# EasyEDA schematic 1-Schematic_Antenna power supply (SMD).json
TITLE: Antenna power supply (SMD): Main module; REV: 1.5.EE; Date: 2019-10-30; Sheet: 1/1; Drawn By: IgrikXD
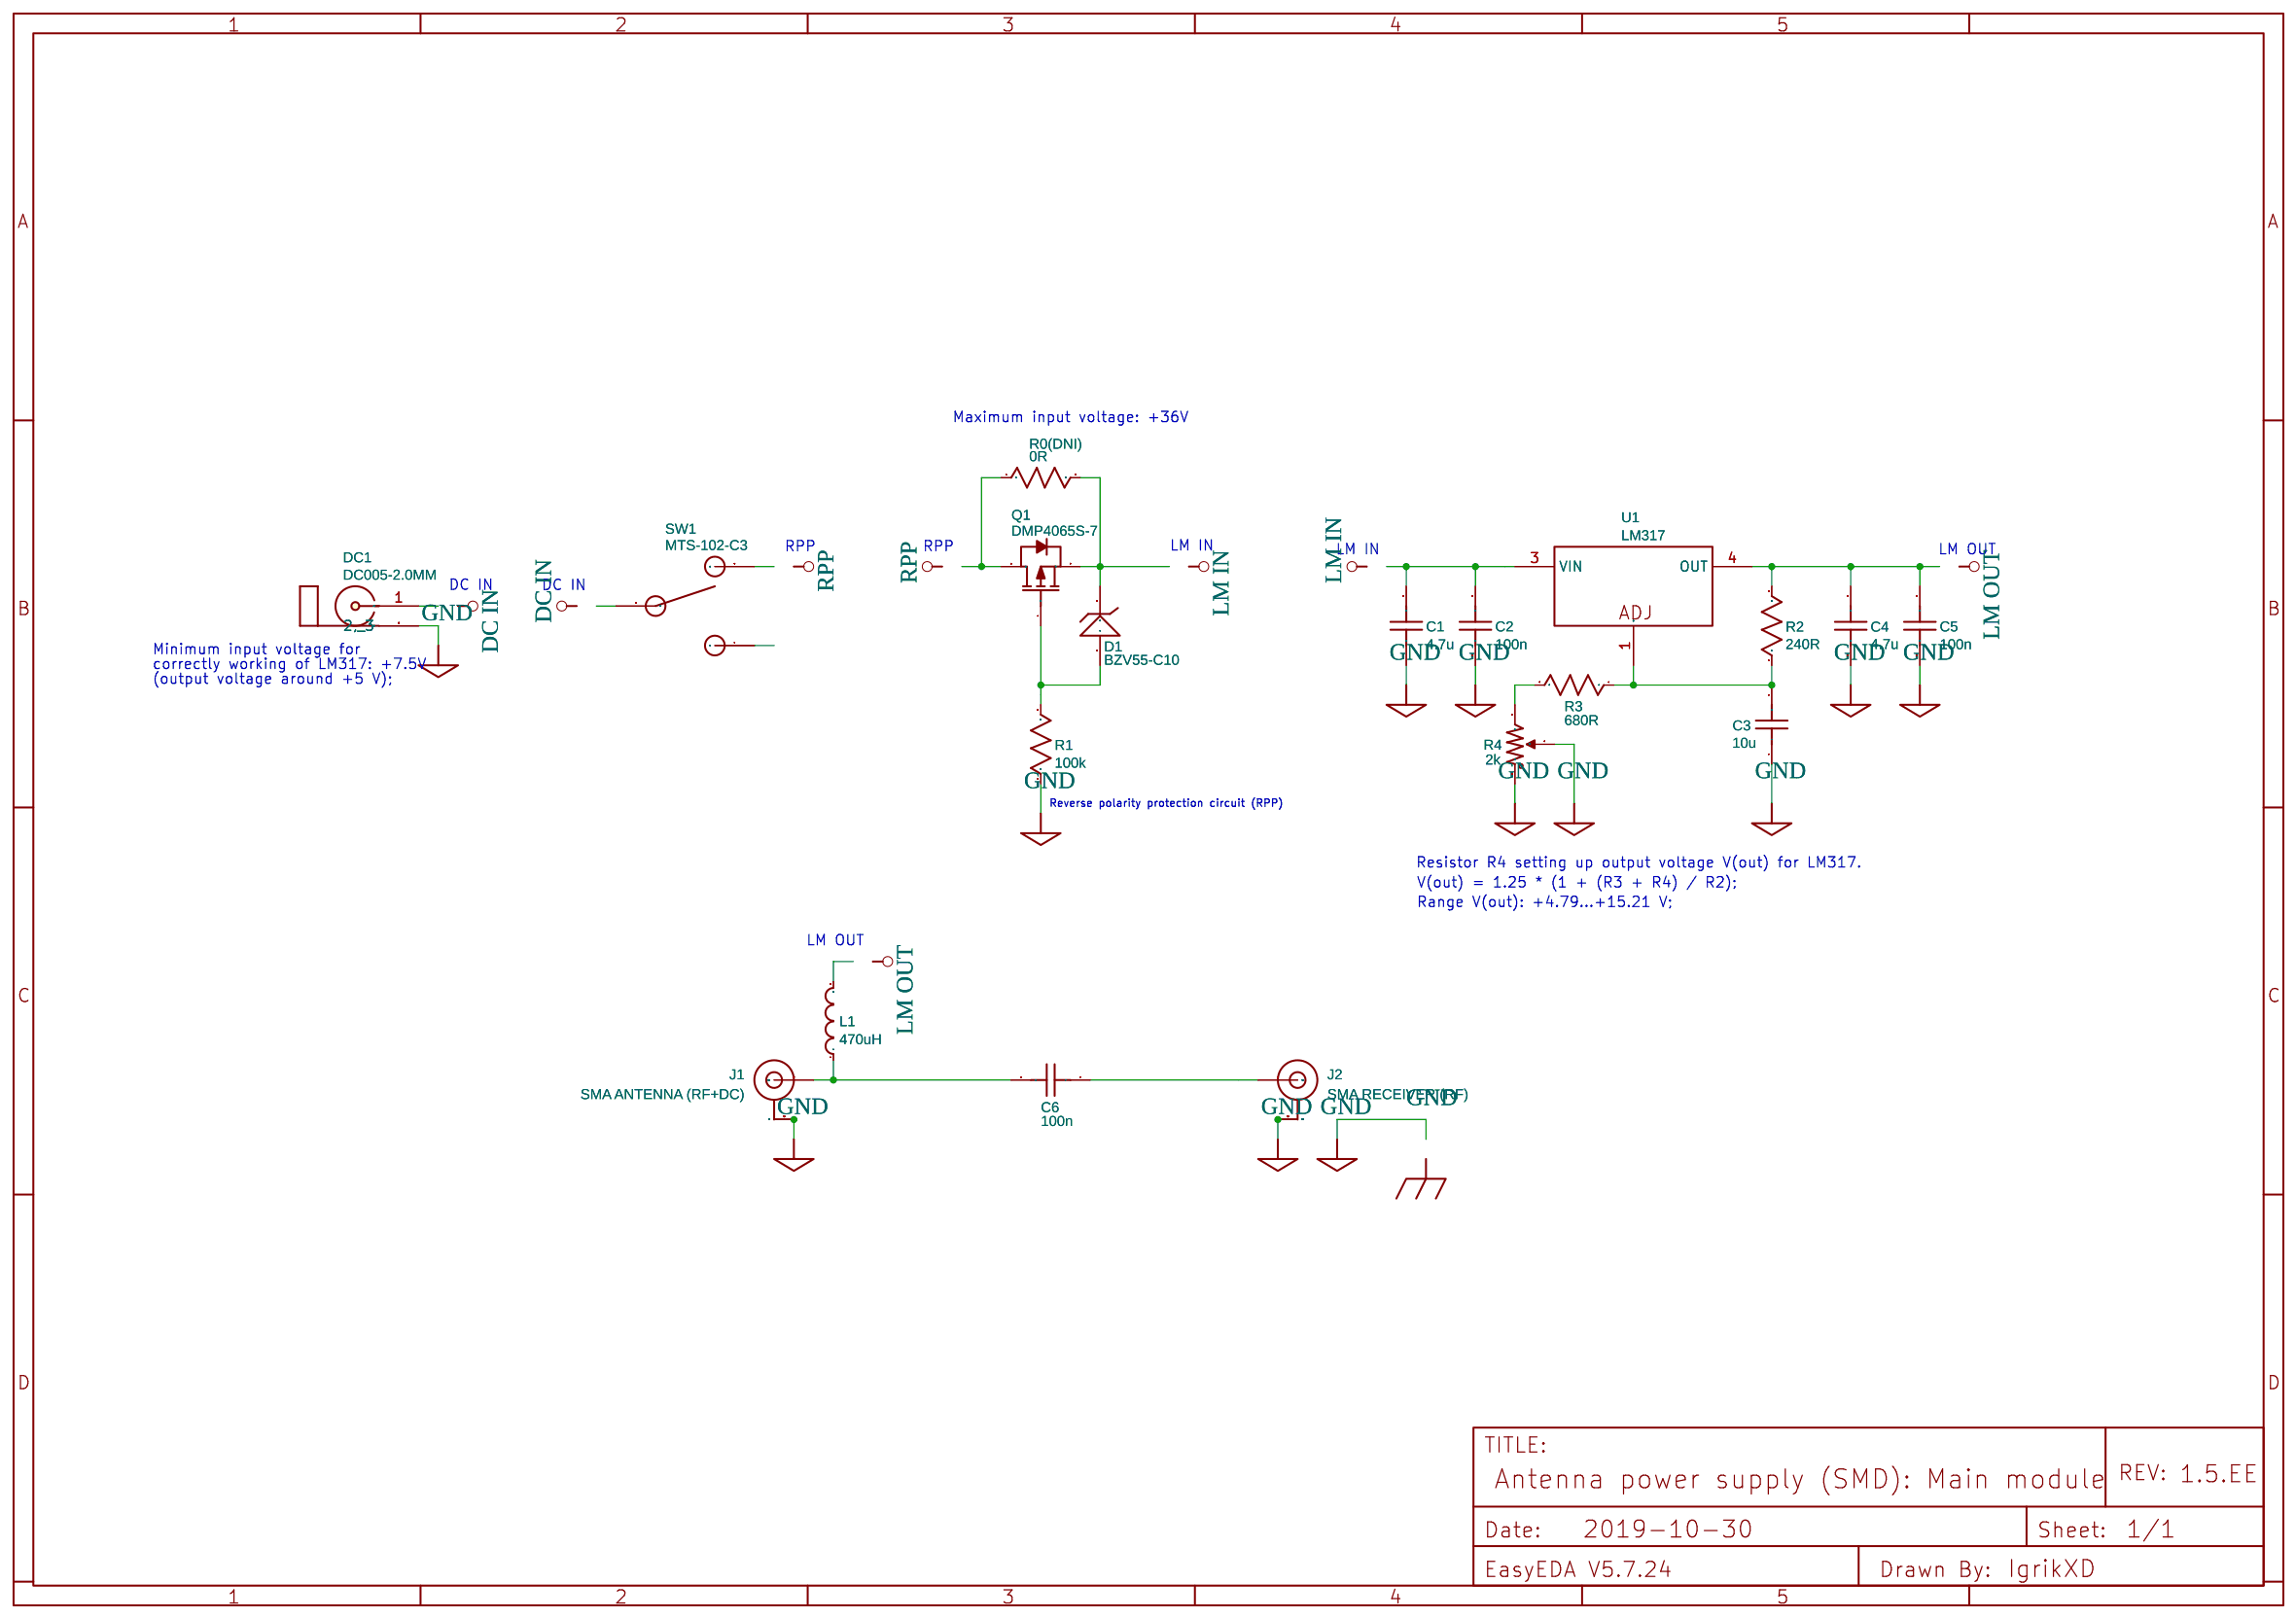
[diagram p0: schematic sheet]

## Parts
C1  4.7u  [0805]
C2  100n  [0805]
C3  10u  [0805]
C4  4.7u  [0805]
C5  100n  [0805]
C6  100n  [0805]
D1  BZV55-C10  [SOD-80C]
DC1  DC005-2.0MM  [DC-5020]
J1  SMA ANTENNA (RF+DC)  [SMA-EDGE]
J2  SMA RECEIVER (RF)  [SMA-EDGE]
L1  470uH  [7850]
Q1  DMP4065S-7  [SOT-23(SOT-23-3)]
R0(DNI)  0R  [0805]
R1  100k  [0805]
R2  240R  [0805]
R3  680R  [0805]
R4  2k  [RES-ADJ_3296W]
SW1  MTS-102-C3  [MTS-102-C3]
U1  LM317  [TO-252-2]

## Library data of the parts
C1 C4 = Capacitor: Manufacturer Part: C0805B475K050T; Supplier: LCSC; Manufacturer: Holy Stone Enterprise; Supplier Part: C105911
C2 C5 C6 = Capacitor: Manufacturer Part: 08055C104JAT2A; Supplier: LCSC; Manufacturer: AVX; Supplier Part: C129175
C3 = Capacitor: Manufacturer Part: GRM21BR71A106KE51L; Supplier: LCSC; Manufacturer: MuRata; Supplier Part: C86038
D1 = -: catid: 20; Supplier: LCSC; Manufacturer: NXP Semicon; Supplier Part: C108431
DC1 = -: Supplier Part: C16214; Supplier: LCSC; Manufacturer: BOOMELE; Manufacturer Part: DC-005 5.5-2.0; Contributor: IgrikXD
J1 = -: catid: 20; Contributor: Pinoccio; Manufacturer Part: ANKX01.0093; Manufacturer: RFsister; Supplier: LCSC; Supplier Part: C129604
J2 = -: catid: 20; Contributor: Pinoccio; Manufacturer Part: ANKX01.0093; Supplier: LCSC; Manufacturer: RFsister; Supplier Part: C129604
L1 = -: Supplier: LCSC; Manufacturer: SXN; Manufacturer Part: SM7850-471MT; Supplier Part: C10158
Q1 = -: Supplier: LCSC; Manufacturer: Diodes Incorporated; Supplier Part: C182476
R0(DNI) = Res_0805(1/8W)_US: Manufacturer Part: CR0805F80000G; Supplier Part: C101402; Supplier: LCSC; Manufacturer: LIZ Elec
R1 = Resistor: Manufacturer Part: RC0805FR-07100KL; Supplier: LCSC; Manufacturer: YAGEO; Supplier Part: C96346
R2 = Resistor: Manufacturer Part: CR0805F82400G; Supplier: LCSC; Manufacturer: LIZ; Supplier Part: C101586
R3 = Resistor: Manufacturer Part: 0805W8F6800T5E; Supplier: LCSC; Manufacturer: Uniroyal Elec; Supplier Part: C17798
R4 = Potentiometer: Manufacturer Part: 3296W-1-202LF; Supplier: LCSC; Manufacturer: Made in China; Supplier Part: C5028
SW1 = -: Contributor: snhunter; sourceId: LjTecMmIi
U1 = -: Supplier: LCSC; Manufacturer: UTC; Manufacturer Part: LM317AG-TN3-R; Supplier Part: C75510

## Nets
GND: C1.1 C2.1 C3.1 C4.1 C5.1 DC1.2(2, 3) DC1.3 J1.GND@0(GND) J1.GND@1(GND) J1.GND@2(GND) J1.GND@3(GND) J2.GND@0(GND) J2.GND@1(GND) J2.GND@2(GND) J2.GND@3(GND) R1.1 R4.2(3) R4.3(2)
DC IN: DC1.1(VCC) SW1.2
LM IN: C1.2 C2.2 D1.2(C) Q1.2(S) R0(DNI).2 U1.3(VIN)
LM OUT: C4.2 C5.2 L1.2 R2.2 U1.4(OUT)
RPP: Q1.3(D) R0(DNI).1 SW1.3
Net-(C3-2): C3.2 R2.1 R3.1 U1.1(ADJ)
Net-(C6-1): C6.1 J2.SIG(SIGNAL)
Net-(C6-2): C6.2 J1.SIG(SIGNAL) L1.1
Net-(D1-1): D1.1(A) Q1.1(G) R1.2
Net-(R3-2): R3.2 R4.1

Not connected (* = marked no-connect by the designer): SW1 1

## Notes on the sheet
- Maximum input voltage: +36V
- RPP
- RPP
- LM IN
- LM IN
- LM OUT
- DC IN
- DC IN
- Minimum input voltage for
- (output voltage around +5 V);
- correctly working of LM317: +7.5V
- Reverse polarity protection circuit (RPP)
- Resistor R4 setting up output voltage V(out) for LM317.
- V(out) = 1.25 * (1 + (R3 + R4) / R2);
- Range V(out): +4.79...+15.21 V;
- LM OUT
